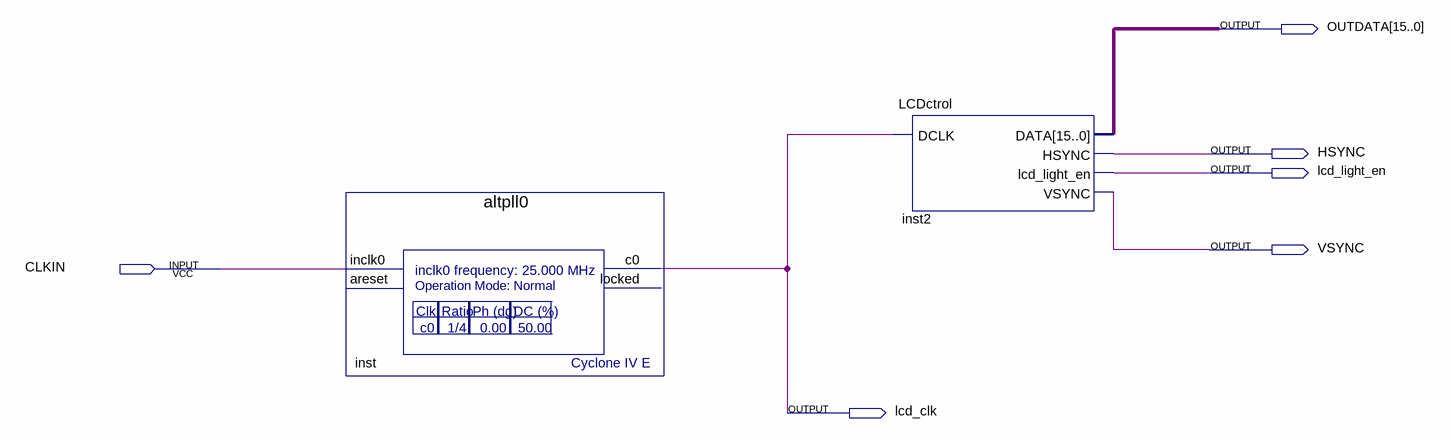
[diagram p0: schematic sheet]
// Quartus schematic LCD.bdf as structural Verilog: 2 symbols, 6 pins
module LCD (
  input  CLKIN,
  output [15:0] OUTDATA,
  output HSYNC,
  output lcd_light_en,
  output VSYNC,
  output lcd_clk
);

  altpll0 inst (.inclk0(CLKIN), .c0(lcd_clk));  // open: areset, locked
  LCDctrol inst2 (.DCLK(lcd_clk), .DATA(OUTDATA), .HSYNC(HSYNC), .lcd_light_en(lcd_light_en), .VSYNC(VSYNC));
endmodule
